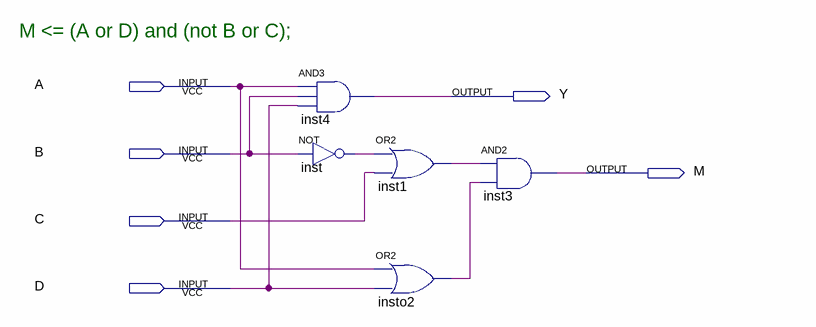
[diagram p0: schematic sheet]
// Quartus schematic BeaconAEs.bdf as structural Verilog: 5 symbols, 6 pins
module BeaconAEs (
  input  A,
  input  B,
  input  C,
  input  D,
  output Y,
  output M
);

  wire inst1_out, inst_out, insto2_out;

  and inst4 (Y, A, B, D);
  not inst (inst_out, B);
  or inst1 (inst1_out, inst_out, C);
  or insto2 (insto2_out, A, D);
  and inst3 (M, inst1_out, insto2_out);

  // Notes on the sheet:
  //   M <= (A or D) and (not B or C);
endmodule
